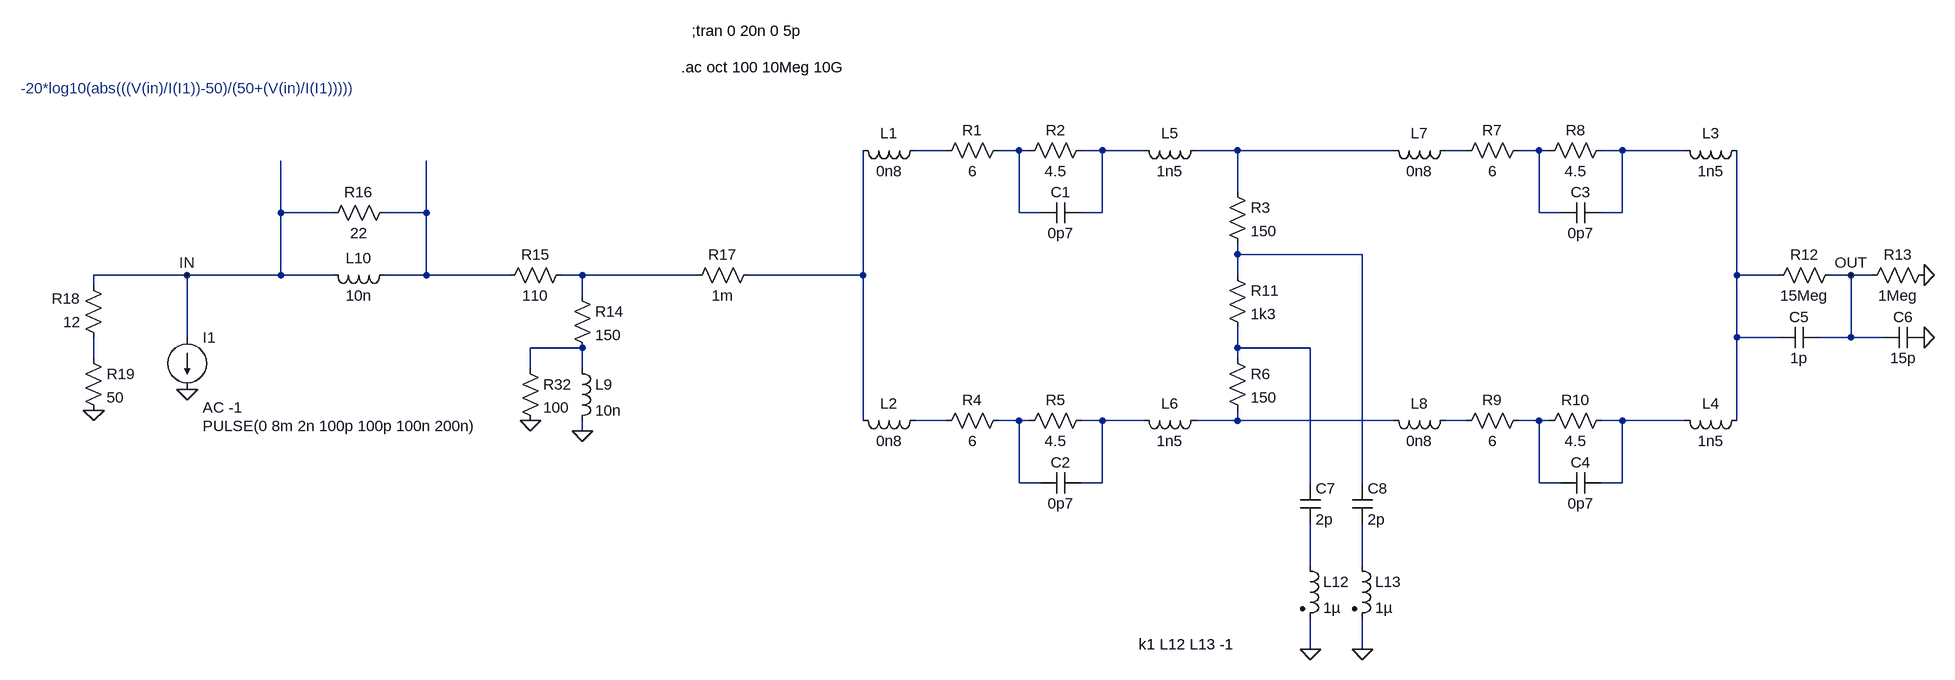
[diagram p0: schematic Draft12.asc]
Draft12.asc, the LTspice schematic file:
Version 4
SHEET 1 1476 1316
WIRE -48 -16 -96 -16
WIRE 64 -16 32 -16
WIRE 80 -16 64 -16
WIRE 192 -16 160 -16
WIRE 256 -16 192 -16
WIRE 400 -16 336 -16
WIRE 640 -16 400 -16
WIRE 752 -16 720 -16
WIRE 864 -16 832 -16
WIRE 880 -16 864 -16
WIRE 992 -16 960 -16
WIRE 1088 -16 992 -16
WIRE 400 48 400 -16
WIRE -1072 80 -1072 0
WIRE -992 80 -1072 80
WIRE -848 80 -848 0
WIRE -848 80 -912 80
WIRE 64 80 64 -16
WIRE 96 80 64 80
WIRE 192 80 192 -16
WIRE 192 80 160 80
WIRE 864 80 864 -16
WIRE 896 80 864 80
WIRE 992 80 992 -16
WIRE 992 80 960 80
WIRE 400 144 400 128
WIRE 592 144 400 144
WIRE -1216 176 -1360 176
WIRE -1072 176 -1072 80
WIRE -1072 176 -1216 176
WIRE -992 176 -1072 176
WIRE -848 176 -848 80
WIRE -848 176 -912 176
WIRE -720 176 -848 176
WIRE -608 176 -640 176
WIRE -432 176 -608 176
WIRE -176 176 -176 -16
WIRE -176 176 -352 176
WIRE 400 176 400 144
WIRE 1168 176 1168 -16
WIRE 1232 176 1168 176
WIRE 1344 176 1312 176
WIRE 1376 176 1344 176
WIRE -1360 192 -1360 176
WIRE -608 208 -608 176
WIRE -1216 272 -1216 176
WIRE 1168 272 1168 176
WIRE 1232 272 1168 272
WIRE 1344 272 1344 176
WIRE 1344 272 1296 272
WIRE 1392 272 1344 272
WIRE -608 288 -688 288
WIRE 400 288 400 256
WIRE 512 288 400 288
WIRE -1360 304 -1360 272
WIRE 400 304 400 288
WIRE -688 320 -688 288
WIRE -608 320 -608 288
WIRE -176 400 -176 176
WIRE -48 400 -96 400
WIRE 64 400 32 400
WIRE 80 400 64 400
WIRE 192 400 160 400
WIRE 256 400 192 400
WIRE 400 400 400 384
WIRE 400 400 336 400
WIRE 640 400 400 400
WIRE 752 400 720 400
WIRE 864 400 832 400
WIRE 880 400 864 400
WIRE 992 400 960 400
WIRE 1088 400 992 400
WIRE 1168 400 1168 272
WIRE -608 416 -608 400
WIRE 64 496 64 400
WIRE 96 496 64 496
WIRE 192 496 192 400
WIRE 192 496 160 496
WIRE 512 496 512 288
WIRE 592 496 592 144
WIRE 864 496 864 400
WIRE 896 496 864 496
WIRE 992 496 992 400
WIRE 992 496 960 496
WIRE 512 624 512 560
WIRE 592 624 592 560
WIRE 512 752 512 704
WIRE 592 752 592 704
FLAG 1456 176 0
FLAG 1456 272 0
FLAG -1216 352 0
FLAG -1216 176 IN
FLAG -1360 384 0
FLAG -608 416 0
FLAG -688 400 0
FLAG 512 752 0
FLAG 592 752 0
FLAG 1344 176 OUT
SYMBOL res 48 -32 R90
WINDOW 0 0 56 VBottom 2
WINDOW 3 32 56 VTop 2
SYMATTR InstName R1
SYMATTR Value 6
SYMBOL res 176 -32 R90
WINDOW 0 0 56 VBottom 2
WINDOW 3 32 56 VTop 2
SYMATTR InstName R2
SYMATTR Value 4.5
SYMBOL cap 160 64 R90
WINDOW 0 0 32 VBottom 2
WINDOW 3 32 32 VTop 2
SYMATTR InstName C1
SYMATTR Value 0p7
SYMBOL res 384 32 R0
SYMATTR InstName R3
SYMATTR Value 150
SYMBOL res 48 384 R90
WINDOW 0 0 56 VBottom 2
WINDOW 3 32 56 VTop 2
SYMATTR InstName R4
SYMATTR Value 6
SYMBOL res 176 384 R90
WINDOW 0 0 56 VBottom 2
WINDOW 3 32 56 VTop 2
SYMATTR InstName R5
SYMATTR Value 4.5
SYMBOL cap 160 480 R90
WINDOW 0 0 32 VBottom 2
WINDOW 3 32 32 VTop 2
SYMATTR InstName C2
SYMATTR Value 0p7
SYMBOL res 384 288 R0
SYMATTR InstName R6
SYMATTR Value 150
SYMBOL res 848 -32 R90
WINDOW 0 0 56 VBottom 2
WINDOW 3 32 56 VTop 2
SYMATTR InstName R7
SYMATTR Value 6
SYMBOL res 976 -32 R90
WINDOW 0 0 56 VBottom 2
WINDOW 3 32 56 VTop 2
SYMATTR InstName R8
SYMATTR Value 4.5
SYMBOL cap 960 64 R90
WINDOW 0 0 32 VBottom 2
WINDOW 3 32 32 VTop 2
SYMATTR InstName C3
SYMATTR Value 0p7
SYMBOL res 848 384 R90
WINDOW 0 0 56 VBottom 2
WINDOW 3 32 56 VTop 2
SYMATTR InstName R9
SYMATTR Value 6
SYMBOL res 976 384 R90
WINDOW 0 0 56 VBottom 2
WINDOW 3 32 56 VTop 2
SYMATTR InstName R10
SYMATTR Value 4.5
SYMBOL cap 960 480 R90
WINDOW 0 0 32 VBottom 2
WINDOW 3 32 32 VTop 2
SYMATTR InstName C4
SYMATTR Value 0p7
SYMBOL res 384 160 R0
SYMATTR InstName R11
SYMATTR Value 1k3
SYMBOL res 1328 160 R90
WINDOW 0 0 56 VBottom 2
WINDOW 3 32 56 VTop 2
SYMATTR InstName R12
SYMATTR Value 15Meg
SYMBOL res 1472 160 R90
WINDOW 0 0 56 VBottom 2
WINDOW 3 32 56 VTop 2
SYMATTR InstName R13
SYMATTR Value 1Meg
SYMBOL cap 1296 256 R90
WINDOW 0 0 32 VBottom 2
WINDOW 3 32 32 VTop 2
SYMATTR InstName C5
SYMATTR Value 1p
SYMBOL cap 1456 256 R90
WINDOW 0 0 32 VBottom 2
WINDOW 3 32 32 VTop 2
SYMATTR InstName C6
SYMATTR Value 15p
SYMBOL current -1216 272 R0
WINDOW 3 24 136 Left 2
WINDOW 123 24 108 Left 2
WINDOW 39 0 0 Left 0
SYMATTR Value PULSE(0 8m 2n 100p 100p 100n 200n)
SYMATTR Value2 AC -1
SYMATTR InstName I1
SYMBOL ind -80 -32 R90
WINDOW 0 5 56 VBottom 2
WINDOW 3 32 56 VTop 2
SYMATTR InstName L1
SYMATTR Value 0n8
SYMBOL ind -80 384 R90
WINDOW 0 5 56 VBottom 2
WINDOW 3 32 56 VTop 2
SYMATTR InstName L2
SYMATTR Value 0n8
SYMBOL ind 1184 -32 R90
WINDOW 0 5 56 VBottom 2
WINDOW 3 32 56 VTop 2
SYMATTR InstName L3
SYMATTR Value 1n5
SYMBOL ind 1184 384 R90
WINDOW 0 5 56 VBottom 2
WINDOW 3 32 56 VTop 2
SYMATTR InstName L4
SYMATTR Value 1n5
SYMBOL cap 496 496 R0
SYMATTR InstName C7
SYMATTR Value 2p
SYMBOL cap 576 496 R0
SYMATTR InstName C8
SYMATTR Value 2p
SYMBOL res -624 192 R0
SYMATTR InstName R14
SYMATTR Value 150
SYMBOL res -624 160 R90
WINDOW 0 0 56 VBottom 2
WINDOW 3 32 56 VTop 2
SYMATTR InstName R15
SYMATTR Value 110
SYMBOL res -1344 288 R180
WINDOW 0 36 76 Left 2
WINDOW 3 36 40 Left 2
SYMATTR InstName R18
SYMATTR Value 12
SYMBOL res -1376 288 R0
SYMATTR InstName R19
SYMATTR Value 50
SYMBOL ind 352 -32 R90
WINDOW 0 5 56 VBottom 2
WINDOW 3 32 56 VTop 2
SYMATTR InstName L5
SYMATTR Value 1n5
SYMBOL ind 352 384 R90
WINDOW 0 5 56 VBottom 2
WINDOW 3 32 56 VTop 2
SYMATTR InstName L6
SYMATTR Value 1n5
SYMBOL ind 736 -32 R90
WINDOW 0 5 56 VBottom 2
WINDOW 3 32 56 VTop 2
SYMATTR InstName L7
SYMATTR Value 0n8
SYMBOL ind 736 384 R90
WINDOW 0 5 56 VBottom 2
WINDOW 3 32 56 VTop 2
SYMATTR InstName L8
SYMATTR Value 0n8
SYMBOL ind -624 304 R0
SYMATTR InstName L9
SYMATTR Value 10n
SYMBOL res -704 304 R0
SYMATTR InstName R32
SYMATTR Value 100
SYMBOL ind2 496 608 R0
SYMATTR InstName L12
SYMATTR Value 1µ
SYMATTR Type ind
SYMBOL ind2 576 608 R0
SYMATTR InstName L13
SYMATTR Value 1µ
SYMATTR Type ind
SYMBOL ind -896 160 R90
WINDOW 0 5 56 VBottom 2
WINDOW 3 32 56 VTop 2
SYMATTR InstName L10
SYMATTR Value 10n
SYMBOL res -896 64 R90
WINDOW 0 0 56 VBottom 2
WINDOW 3 32 56 VTop 2
SYMATTR InstName R16
SYMATTR Value 22
SYMBOL res -336 160 R90
WINDOW 0 0 56 VBottom 2
WINDOW 3 32 56 VTop 2
SYMATTR InstName R17
SYMATTR Value 1m
TEXT -456 -144 Left 2 !.ac oct 100 10Meg 10G
TEXT -440 -200 Left 2 !;tran 0 20n 0 5p
TEXT -1472 -112 Left 2 ;-20*log10(abs(((V(in)/I(I1))-50)/(50+(V(in)/I(I1)))))
TEXT 248 744 Left 2 !k1 L12 L13 -1

The netlist it stands for:
* Draft12.asc
R1 N002 N001 6
R2 N003 N002 4.5
C1 N003 N002 0p7
R3 N004 N009 150
R4 N017 N016 6
R5 N018 N017 4.5
C2 N018 N017 0p7
R6 N014 N019 150
R7 N006 N005 6
R8 N007 N006 4.5
C3 N007 N006 0p7
R9 N021 N020 6
R10 N022 N021 4.5
C4 N022 N021 0p7
R11 N009 N014 1k3
R12 OUT N012 15Meg
R13 0 OUT 1Meg
C5 OUT N012 1p
C6 0 OUT 15p
I1 IN 0 PULSE(0 8m 2n 100p 100p 100n 200n) AC -1
L1 N001 N011 0n8
L2 N016 N011 0n8
L3 N012 N007 1n5
L4 N012 N022 1n5
C7 N014 N023 2p
C8 N009 N024 2p
R14 N010 N013 150
R15 N010 N008 110
R18 N015 IN 12
R19 N015 0 50
L5 N004 N003 1n5
L6 N019 N018 1n5
L7 N005 N004 0n8
L8 N020 N019 0n8
L9 N013 0 10n
R32 N013 0 100
L12 N023 0 1µ
L13 N024 0 1µ
L10 N008 IN 10n
R16 N008 IN 22
R17 N011 N010 1m
.ac oct 100 10Meg 10G
;tran 0 20n 0 5p
* -20*log10(abs(((V(in)/I(I1))-50)/(50+(V(in)/I(I1)))))
k1 L12 L13 -1
.backanno
.end